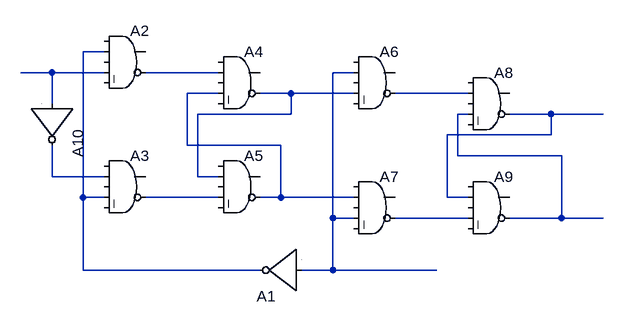
[diagram p0: schematic D-FF.asc]
D-FF.asc, the LTspice schematic file:
Version 4
SHEET 1 880 680
WIRE 32 64 0 64
WIRE -48 96 -96 96
WIRE 32 96 -48 96
WIRE 208 96 96 96
WIRE 416 96 384 96
WIRE 208 128 160 128
WIRE 320 128 272 128
WIRE 416 128 320 128
WIRE 592 128 480 128
WIRE -48 144 -48 96
WIRE 320 160 320 128
WIRE 320 160 176 160
WIRE 592 160 576 160
WIRE 720 160 656 160
WIRE 800 160 720 160
WIRE 720 192 720 160
WIRE 720 192 560 192
WIRE 160 208 160 128
WIRE 304 208 160 208
WIRE 576 224 576 160
WIRE 736 224 576 224
WIRE -48 256 -48 208
WIRE 32 256 -48 256
WIRE 176 256 176 160
WIRE 208 256 176 256
WIRE 0 288 0 64
WIRE 32 288 0 288
WIRE 208 288 96 288
WIRE 304 288 304 208
WIRE 304 288 272 288
WIRE 416 288 304 288
WIRE 560 288 560 192
WIRE 592 288 560 288
WIRE 384 320 384 96
WIRE 416 320 384 320
WIRE 592 320 480 320
WIRE 736 320 736 224
WIRE 736 320 656 320
WIRE 800 320 736 320
WIRE 0 400 0 288
WIRE 272 400 0 400
WIRE 384 400 384 320
WIRE 384 400 336 400
WIRE 544 400 384 400
SYMBOL Digital\\inv 336 464 R180
SYMATTR InstName A1
SYMBOL Digital\\and 64 16 R0
SYMATTR InstName A2
SYMBOL Digital\\and 64 208 R0
SYMATTR InstName A3
SYMBOL Digital\\and 240 48 R0
SYMATTR InstName A4
SYMBOL Digital\\and 240 208 R0
SYMATTR InstName A5
SYMBOL Digital\\and 448 48 R0
SYMATTR InstName A6
SYMBOL Digital\\and 448 240 R0
SYMATTR InstName A7
SYMBOL Digital\\and 624 80 R0
SYMATTR InstName A8
SYMBOL Digital\\and 624 240 R0
SYMATTR InstName A9
SYMBOL Digital\\inv 16 144 R90
SYMATTR InstName A10

The netlist it stands for:
* D-FF.asc
A1 N004 0 0 0 0 N001 0 0 BUF
A2 0 N001 0 N002 0 N003 0 0 AND
A3 0 N010 0 N001 0 N011 0 0 AND
A4 0 N003 0 N005 0 N006 0 0 AND
A5 0 N006 0 N011 0 N005 0 0 AND
A6 0 N004 0 N006 0 N007 0 0 AND
A7 0 N005 0 N004 0 N012 0 0 AND
A8 0 N007 0 N008 0 N009 0 0 AND
A9 0 N009 0 N012 0 N008 0 0 AND
A10 N002 0 0 0 0 N010 0 0 BUF
.backanno
.end